# EAGLE design untitled (EAGLE 5.08)
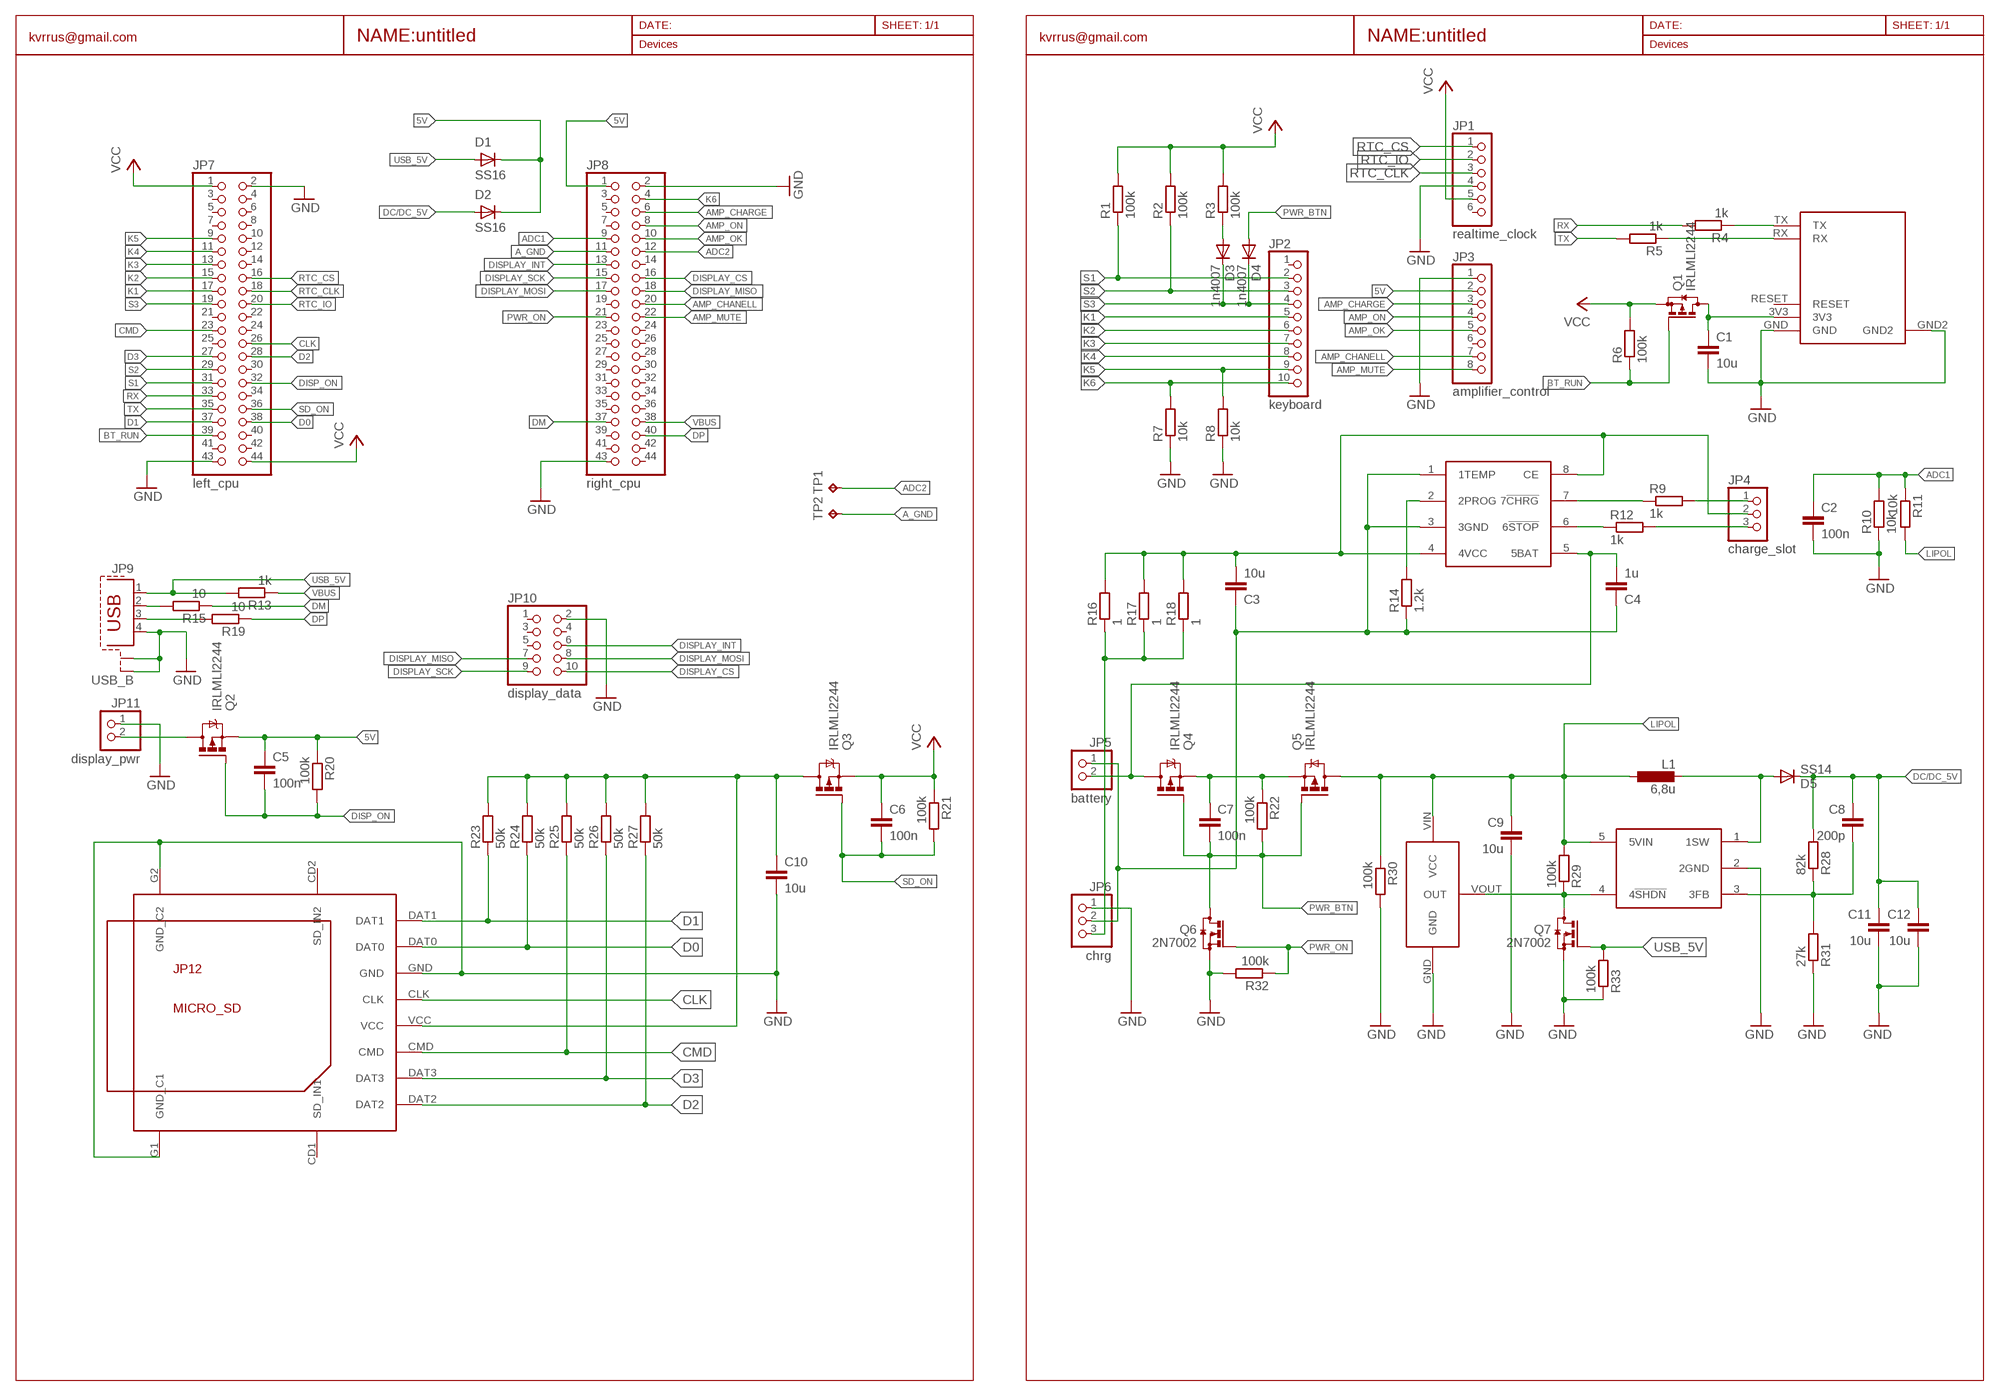
[diagram p0: schematic, sheet 1]

## Parts
C1  10u  C-EUC0805  [C0805]
C2  100n  C-EUC0805  [C0805]
C3  10u  C-EUC0805  [C0805]
C4  1u  C-EUC0805  [C0805]
C5  100n  C-EUC0805  [C0805]
C6  100n  C-EUC0805  [C0805]
C7  100n  C-EUC0805  [C0805]
C8  200p  C-EUC0805  [C0805]
C9  10u  C-EUC0805  [C0805]
C10  10u  C-EUC0805  [C0805]
C11  10u  C-EUC0805  [C0805]
C12  10u  C-EUC0805  [C0805]
D1  SS16  GF1  [SMA-DO214AC]
D2  SS16  GF1  [SMA-DO214AC]
D3  1n4007  CGRM4007-G  [SOD-123_MINI-SMA]
D4  1n4007  CGRM4007-G  [SOD-123_MINI-SMA]
D5  SS14  MBR0520LT  [SOD123]
JP1  realtime_clock  PINHD-1X6  [1X06]
JP2  keyboard  PINHD-1X10  [1X10]
JP3  amplifier_control  PINHD-1X08_2.00  [1X08M]
JP4  charge_slot  PINHD-1X3  [1X03]
JP5  battery  PINHD-1X2  [1X02]
JP6  chrg  PINHD-1X3  [1X03]
JP7  left_cpu  PINHD-2X22_2.54-SMD  [2X22SMD]
JP8  right_cpu  PINHD-2X22_2.54-SMD  [2X22SMD]
JP9  USB_B  PN61729-S  [PN61729-S]
JP10  display_data  PINHD-2X05_2.54-SMD  [2X05SMD]
JP11  display_pwr  PINHD-1X2  [1X02]
JP12  MICRO_SD  [MICRO_SD_EASY]
L1  6,8u  L-EUPIS2816  [PIS2816]
Q1  IRLMLl2244  BSS84  [SOT23]
Q2  IRLMLl2244  IRLML5203  [MICRO3]
Q3  IRLMLl2244  IRLML5203  [MICRO3]
Q4  IRLMLl2244  IRLML5203  [MICRO3]
Q5  IRLMLl2244  IRLML5203  [MICRO3]
Q6  2N7002  BSS123  [SOT23]
Q7  2N7002  BSS123  [SOT23]
R1  100k  R-EU_M1206  [M1206]
R2  100k  R-EU_M1206  [M1206]
R3  100k  R-EU_M0805  [M0805]
R4  1k  R-EU_M0805  [M0805]
R5  1k  R-EU_M0805  [M0805]
R6  100k  R-EU_M0805  [M0805]
R7  10k  R-EU_M0805  [M0805]
R8  10k  R-EU_M0805  [M0805]
R9  1k  R-EU_M0805  [M0805]
R10  10k  R-EU_M0805  [M0805]
R11  10k  R-EU_M0805  [M0805]
R12  1k  R-EU_M0805  [M0805]
R13  1k  R-EU_M0805  [M0805]
R14  1.2k  R-EU_M0805  [M0805]
R15  10  R-EU_M0805  [M0805]
R16  1  R-EU_M0805  [M0805]
R17  1  R-EU_M0805  [M0805]
R18  1  R-EU_M0805  [M0805]
R19  10  R-EU_M0805  [M0805]
R20  100k  R-EU_M0805  [M0805]
R21  100k  R-EU_M0805  [M0805]
R22  100k  R-EU_M0805  [M0805]
R23  50k  R-EU_M0805  [M0805]
R24  50k  R-EU_M0805  [M0805]
R25  50k  R-EU_M0805  [M0805]
R26  50k  R-EU_M0805  [M0805]
R27  50k  R-EU_M0805  [M0805]
R28  82k  R-EU_M0805  [M0805]
R29  100k  R-EU_M0805  [M0805]
R30  100k  R-EU_M0805  [M0805]
R31  27k  R-EU_M0805  [M0805]
R32  100k  R-EU_M0805  [M0805]
R33  100k  R-EU_M0805  [M0805]
TP1  TPPAD1-13  [P1-13]
TP2  TPPAD1-13  [P1-13]
U$1  BLUETOOTH  [BLUETOOTH]
U$2  TP4056  [SO08]
U$3  LM2731  [SOT23-5]
U$5  UVLO  [TO-92]

## Nets
5V: C5.1 D1.K(C) D2.K(C) JP3.2 JP8.1 Q2.2(S) R20.1
A_GND: JP8.11 TP2.TP
ADC1: C2.1 JP8.9 R10.2 R11.1
ADC2: JP8.12 TP1.TP
AMP_CHANELL: JP3.7 JP8.20
AMP_CHARGE: JP3.3 JP8.6
AMP_MUTE: JP3.8 JP8.22
AMP_OK: JP3.5 JP8.10
AMP_ON: JP3.4 JP8.8
BT_RUN: JP7.39 Q1.1(G) R6.1
CLK: JP7.26 JP12.CLK
CMD: JP7.23 JP12.CMD R25.1
D0: JP7.38 JP12.DAT0 R24.1
D1: JP7.37 JP12.DAT1 R23.1
D2: JP7.28 JP12.DAT2 R27.1
D3: JP7.27 JP12.DAT3 R26.1
DC/DC_5V: C8.1 C11.1 C12.1 D2.A D5.C R28.2
DISP_ON: C5.2 JP7.32 Q2.1(G) R20.2
DISPLAY_CS: JP8.16 JP10.10
DISPLAY_INT: JP8.13 JP10.6
DISPLAY_MISO: JP8.18 JP10.7
DISPLAY_MOSI: JP8.17 JP10.8
DISPLAY_SCK: JP8.15 JP10.9
DM: JP8.37 R15.1
DP: JP8.40 R19.1
GND: C1.2 C2.2 C9.2 C10.2 C11.2 C12.2 JP1.4 JP3.1 JP6.1 JP7.2 JP7.43 JP8.2 JP8.43 JP9.4 JP9.S1 JP9.S2 JP10.2 JP11.1 JP12.G1(GND_C1) JP12.G2(GND_C2) JP12.GND Q6.2(S) Q7.2(S) R7.1 R8.1 R10.1 R30.2 R31.1 R32.2 R33.1 U$1.GND U$1.GND2 U$3.2(2GND) U$5.GND
K1: JP2.5 JP7.17
K2: JP2.6 JP7.15
K3: JP2.7 JP7.13
K4: JP2.8 JP7.11
K5: JP2.9 JP7.9 R8.2
K6: JP2.10 JP8.4 R7.2
LIPOL: C9.1 L1.1 Q5.3(D) R11.2 R29.2 R30.1 U$3.5(5VIN) U$5.VIN(VCC)
N$1: R4.1 U$1.TX
N$2: R5.1 U$1.RX
N$3: C7.1 Q4.2(S) Q5.2(S) R22.1
N$4: JP11.2 Q2.3(D)
N$6: JP6.3 R16.1 R17.1 R18.1
N$7: C1.1 Q1.3(D) U$1.3V3
N$8: R14.2 U$2.2(2PROG)
N$9: C8.2 R28.1 R31.2 U$3.3(3FB)
N$10: C4.2 JP5.2 Q4.3(D) U$2.5(5BAT)
N$12: D5.A L1.2 U$3.1(1SW)
N$13: JP9.2 R15.2
N$14: R9.1 U$2.7(7!CHRG)
N$16: D3.A R3.1
N$17: R12.1 U$2.6(6!STOP)
N$18: Q7.3(D) R29.1 U$3.4(4!SHDN) U$5.VOUT(OUT)
N$19: JP4.1 R9.2
N$20: JP4.3 R12.2
N$21: C3.1 C4.1 JP5.1 JP6.2 R14.1 U$2.1(1TEMP) U$2.3(3GND)
N$22: C3.2 JP4.2 R16.2 R17.2 R18.2 U$2.4(4VCC) U$2.8(CE)
N$23: JP9.3 R19.2
N$26: C10.1 JP12.VCC Q3.3(D) R23.2 R24.2 R25.2 R26.2 R27.2
PWR_BTN: C7.2 D4.A Q4.1(G) Q5.1(G) Q6.3(D) R22.2
PWR_ON: JP8.21 Q6.1(G) R32.1
RTC_CLK: JP1.3 JP7.18
RTC_CS: JP1.1 JP7.16
RTC_IO: JP1.2 JP7.20
RX: JP7.33 R4.2
S1: JP2.2 JP7.31 R1.1
S2: JP2.3 JP7.29 R2.1
S3: D3.C D4.C JP2.4 JP7.19
SD_ON: C6.2 JP7.36 Q3.1(G) R21.2
TX: JP7.35 R5.2
USB_5V: D1.A JP9.1 Q7.1(G) R13.2 R33.2
VBUS: JP8.38 R13.1
VCC: C6.1 JP1.5 JP7.1 JP7.44 Q1.2(S) Q3.2(S) R1.2 R2.2 R3.2 R6.2 R21.1
Unconnected: JP1.6 JP2.1 JP3.6 JP7.3 JP7.4 JP7.5 JP7.6 JP7.7 JP7.8 JP7.10 JP7.12 JP7.14 JP7.21 JP7.22 JP7.24 JP7.25 JP7.30 JP7.34 JP7.40 JP7.41 JP7.42 JP8.3 JP8.5 JP8.7 JP8.14 JP8.19 JP8.23 JP8.24 JP8.25 JP8.26 JP8.27 JP8.28 JP8.29 JP8.30 JP8.31 JP8.32 JP8.33 JP8.34 JP8.35 JP8.36 JP8.39 JP8.41 JP8.42 JP8.44 JP10.1 JP10.3 JP10.4 JP10.5 JP12.CD1(SD_IN1) JP12.CD2(SD_IN2) U$1.RESET

## Notes on the sheet
- kvrrus@gmail.com | kvrrus@gmail.com

## Library data of the parts
C1-C12 = rcl:C-EU: CAPACITOR, European symbol
D1 D2 = diode:GF1: DIODE
D3 D4 = diode:CGRM400*-G: Molded plasitc,JEDEC SOD-123/Mini SMA Source: Comchip CGRM4001-G.pdf
D5 = diode:MBR0520LT: SCHOTTKY BARRIER RECTIFIER Source: http://onsemi.com .. MBR0520LT1-D.pdf
JP1 = pinhead:PINHD-1X6: PIN HEADER
JP2 = pinhead:PINHD-1X10: PIN HEADER
JP3 = pinhead-2:PINHD-1X08: PIN HEADER
JP4 JP6 = pinhead:PINHD-1X3: PIN HEADER
JP5 JP11 = pinhead:PINHD-1X2: PIN HEADER
JP7 JP8 = pinhead-2:PINHD-2X22: PIN HEADER
JP9 = con-berg:PN61729-S: BERG USB connector
JP10 = pinhead-2:PINHD-2X05: PIN HEADER
JP12 = connectors:MICRO_SD
L1 = rcl:L-EU: INDUCTOR, European symbol
Q1 = transistor-small-signal:BSS84: P-CHANNEL MOS FET
Q2-Q5 = transistor-power:IRLML5203: HEXFET P-Channel Power MOSFET
Q6 Q7 = transistor-small-signal:BSS123: N-CHANNEL MOS FET
R1-R33 = rcl:R-EU_: RESISTOR, European symbol
TP1 TP2 = testpad:TP: Test pad
U$1 = connectors:BLUETOOTH
U$2 = stabil:TP4056
U$3 = stabil:LM2731
U$5 = stabil:UVLO

## Board
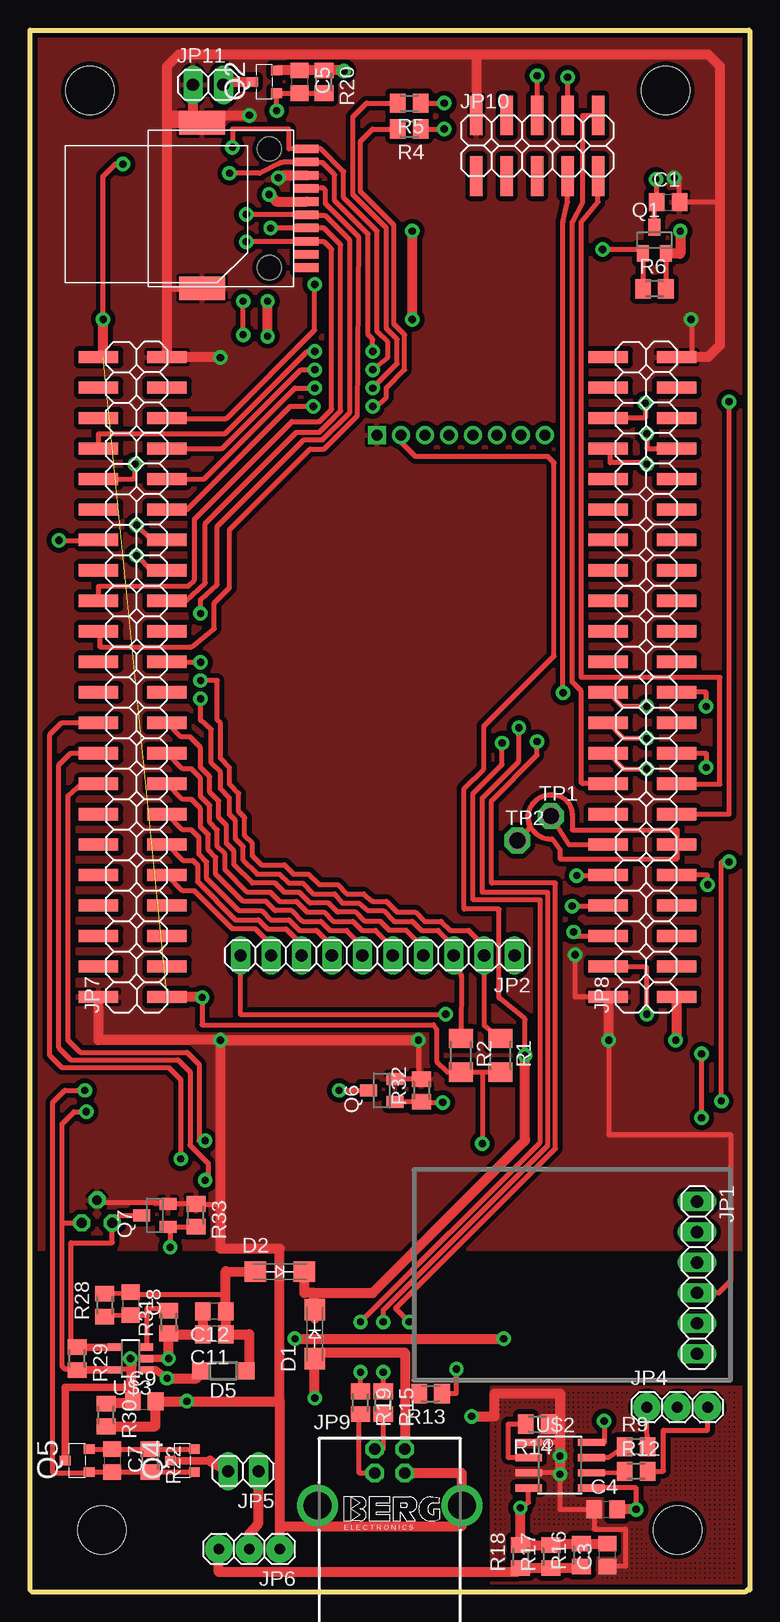
[diagram p1: board, top side]
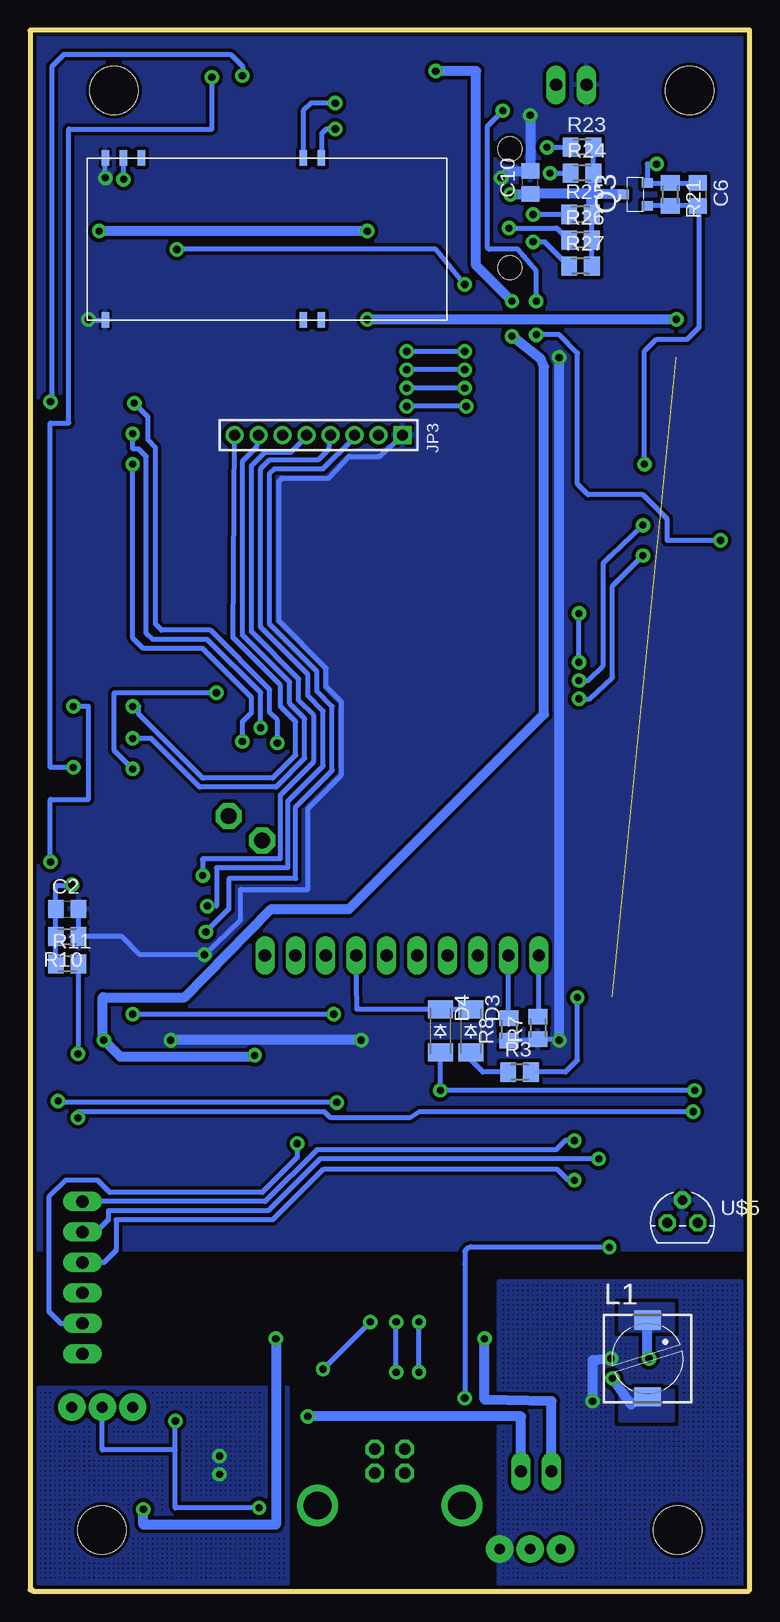
[diagram p2: board, bottom side, seen from below]

Size 60 x 130.18 mm. Coordinates in mm from the lower left corner, seen from the top.
Outline: 0,0.13 0,130.13
Outline: 60,130.13 60,0.13
Outline: 0.13,0 59.69,0 59.94,0.25
Outline: 0,130.18 59.94,130.18
Copper layers (1*16): Top 0.035mm / dielectric 1.5mm / Bottom 0.035mm
Design rules "default *": minimum track width 0.3mm, minimum drill 0.3mm, track to track 0.22mm, track to pad 0.22mm, pad to pad 0.22mm, via to via 0.22mm, smd to smd 0.22mm, copper to edge 0.035mm, drill to drill 0.035mm, minimum pad ring 0.3mm, minimum via ring 0.3mm, stop-mask expansion 4mil, vias tented up to drill 0mil, thermal gap 10mil
Holes 4 mm at 6,5.13 54,5.13 5,125.13 53,125.13

### Footprints (pad centres in the part's own frame; a part is rotated, then mirrored left to right if it is on the bottom)
C0805 = smd 1.3 x 1.5: 1 -0.95,0; 2 0.95,0
SMA-DO214AC = smd 1.8 x 1.7: A -2.05,0; K 2.05,0
SOD-123_MINI-SMA = smd 1.5 x 2.1: A 1.8,0; C -1.8,0
SOD123 = smd 1.4 x 1.4: A 1.9,0; C -1.9,0
1X06 = drill 1.016 long: 1 -6.35,0; 2 -3.81,0; 3 -1.27,0; 4 1.27,0; 5 3.81,0; 6 6.35,0
1X10 = drill 1.016 long: 1 -11.43,0; 2 -8.89,0; 3 -6.35,0; 4 -3.81,0; 5 -1.27,0; 6 1.27,0; 7 3.81,0; 8 6.35,0; 9 8.89,0; 10 11.43,0
1X08M = drill 0.914 square: 1 -7,0 | drill 0.914: 2 -5,0; 3 -3,0; 4 -1,0; 5 1,0; 6 3,0; 7 5,0; 8 7,0
1X03 = drill 0.9 pad 2.286: 1 -2.54,0; 2 0,0; 3 2.54,0
1X02 = drill 1.016 long: 1 -1.27,0; 2 1.27,0
2X22SMD = smd 1.016 x 3.302: 1 -1.27,-3.81; 2 -1.27,1.905; 3 1.27,-3.81; 4 1.27,1.905; 5 3.81,-3.81; 6 3.81,1.905; 7 6.35,-3.81; 8 6.35,1.905; 9 8.89,-3.81; 10 8.89,1.905; 11 11.43,-3.81; 12 11.43,1.905; 13 13.97,-3.81; 14 13.97,1.905; 15 16.51,-3.81; 16 16.51,1.905; 17 19.05,-3.81; 18 19.05,1.905; 19 21.59,-3.81; 20 21.59,1.905; 21 24.13,-3.81; 22 24.13,1.905; 23 26.67,-3.81; 24 26.67,1.905; 25 29.21,-3.81; 26 29.21,1.905; 27 31.75,-3.81; 28 31.75,1.905; 29 34.29,-3.81; 30 34.29,1.905; 31 36.83,-3.81; 32 36.83,1.905; 33 39.37,-3.81; 34 39.37,1.905; 35 41.91,-3.81; 36 41.91,1.905; 37 44.45,-3.81; 38 44.45,1.905; 39 46.99,-3.81; 40 46.99,1.905; 41 49.53,-3.81; 42 49.53,1.905; 43 52.07,-3.81; 44 52.07,1.905
PN61729-S = drill 0.95 octagon: 1 1.25,4.71; 2 -1.25,4.71; 3 -1.25,2.71; 4 1.25,2.71 | drill 2.3 pad 2.9: S1 -6.02,0; S2 6.02,0
2X05SMD = smd 1.016 x 3.302: 1 -1.27,-3.81; 2 -1.27,1.27; 3 1.27,-3.81; 4 1.27,1.27; 5 3.81,-3.81; 6 3.81,1.27; 7 6.35,-3.81; 8 6.35,1.27; 9 8.89,-3.81; 10 8.89,1.27
MICRO_SD_EASY = smd 2 x 0.711: CD1 1.1,0; CD2 1.1,1.1; CLK 1.1,6.6; CMD 1.1,4.4; DAT0 1.1,8.8; DAT1 1.1,9.9; DAT2 1.1,2.2; DAT3 1.1,3.3; GND 1.1,7.7; VCC 1.1,5.5 | smd 3.81 x 1.93: G1 -7.62,-1.735; G2 -7.62,12.065 | hole 2: -2,9.9; -2,0
PIS2816 = smd 2.2 x 1.6: 1 0,3.2; 2 0,-3.2
SOT23 = smd 1 x 1.4: 1 -0.95,-1.1; 2 0.95,-1.1; 3 0,1.1
MICRO3 = smd 0.8 x 0.9: 1 -0.95,-1; 2 0.95,-1; 3 0,1
M1206 = smd 1.6 x 2: 1 -1.4,0; 2 1.4,0
M0805 = smd 1.3 x 1.6: 1 -0.95,0; 2 0.95,0
P1-13 = drill 1.321 pad 2.159 octagon: TP 0,0
BLUETOOTH = smd 1.27 x 0.635: 3V3 0,1.5; GND 0,0; GND2 13.5,0; RESET 0,3; RX 0,16.5; RX_LED 13.5,16.5; TX 0,18; TX_LED 13.5,18
SO08 = smd 0.61 x 2.21: 1 -1.905,-2.616; 2 -0.635,-2.616; 3 0.635,-2.616; 4 1.905,-2.616; 5 1.905,2.616; 6 0.635,2.616; 7 -0.635,2.616; 8 -1.905,2.616
SOT23-5 = smd 0.6 x 1.2: 1 -0.95,-1.306; 2 0,-1.306; 3 0.95,-1.306; 4 0.95,1.306; 5 -0.95,1.306
TO-92 = drill 0.813 octagon: GND 0,1.905; VIN 1.27,0; VOUT -1.27,0

### Placement (x,y rotation side)
C1  53.21,115.82 0 top
C2  56.9,56.9 0 bottom
C3  48.13,3.05 90 top
C4  48.01,6.86 0 top
C5  22.48,125.86 270 top
C6  4.32,116.46 270 bottom
C7  6.86,10.92 270 top
C8  8.38,24 270 top
C9  9.53,15.88 0 top
C10  18.29,117.47 90 bottom
C11  15.37,21.46 180 top
C12  15.37,23.37 180 top
D1  23.75,21.46 90 top
D2  20.83,26.67 0 top
D3  23.24,46.74 270 bottom
D4  25.78,46.74 270 bottom
D5  16.13,18.41 180 top
JP1  55.63,26.16 270 top
JP2  28.98,53.03 180 top
JP3  35.94,96.39 180 bottom
JP4  53.98,15.37 0 top
JP5  17.78,10.03 180 top
JP6  18.29,3.56 180 top
JP7  7.62,50.84 90 top
JP8  50.12,50.84 90 top
JP9  30,7.16 0 top
JP10  38.48,121.79 0 top
JP11  14.86,125.6 0 top
JP12  21.97,110.36 0 top
L1  8.51,19.43 0 bottom
Q1  52.07,112.65 0 top
Q2  19.56,125.86 90 top
Q3  9.53,116.46 90 bottom
Q4  12.7,10.92 90 top
Q5  3.94,10.92 90 top
Q6  29.34,41.78 90 top
Q7  10.41,31.37 90 top
R1  39.24,44.7 270 top
R2  35.94,44.7 270 top
R3  19.18,43.31 0 bottom
R4  31.62,121.92 180 top
R5  31.62,124.08 180 top
R6  52.07,108.58 0 top
R7  17.65,46.99 90 bottom
R8  20.07,46.86 90 bottom
R9  50.55,12.07 0 top
R10  56.9,54.61 180 bottom
R11  56.9,52.32 0 bottom
R12  50.55,10.03 0 top
R13  33.4,16.51 180 top
R14  42.29,13.97 180 top
R15  29.46,15.75 270 top
R16  45.97,3.05 90 top
R17  43.43,2.92 90 top
R18  40.89,2.92 90 top
R19  27.56,15.75 270 top
R20  24.51,125.86 270 top
R21  6.6,116.46 270 bottom
R22  10.03,10.92 270 top
R23  13.97,120.4 0 bottom
R24  13.97,118.24 0 bottom
R25  14.1,114.81 0 bottom
R26  14.1,112.65 0 bottom
R27  14.1,110.49 0 bottom
R28  6.22,23.88 90 top
R29  3.94,19.43 270 top
R30  6.35,14.73 270 top
R31  11.56,22.48 90 top
R32  32.64,41.78 90 top
R33  13.84,31.37 270 top
TP1  43.43,64.64 0 top
TP2  40.64,62.61 0 top
U$1  53.72,119.51 270 bottom
U$2  44.2,10.54 270 top
U$3  8.38,19.43 90 top
U$5  5.59,30.73 0 bottom

### Tracks (layer width: path | path; a pad name or v marks a point on that pad's centre or on a via)
5V  (via drill 0.6)
  Top 0.406: v41.27,44.7 41.27,47.65 arc45 41.2,47.83 39.19,49.46 arc-45 39.12,49.51 39.12,56.9 36.2,56.9 36.2,66.93 37.85,68.58 37.85,72.14 43.69,77.98 43.69,94.11 43.18,94.61 32.13,94.61 31.07,95.68 JP3.2
  Top 0.813: v53.85,45.97 53.93,46.06 JP8.1 | v41.27,44.7 41.27,37.7 arc-45 41.2,37.52 28.57,24.89 23.75,24.89 | v19.81,104.65 v19.81,107.57 | 23.75,24.89 22.88,24.89 D2.K | 23.75,22.75 D1.K 23.75,24.89 | C5.1 22.48,126.75 | C5.1 Q2.2 | C5.1 R20.1 26.16,126.81 v26.16,126.75
  Bottom 0.813: v19.81,107.57 22.8,110.56 22.8,126.75 v26.16,126.75 | v41.27,44.7 41.27,44.58 52.45,44.58 v53.85,45.97 53.93,46.06 JP8.1 53.89,49.53 47.12,49.53 39.88,56.9 33.4,56.9 17.14,73.15 17.14,102.11 17.4,102.74 v19.81,104.65
A_GND
  Top 0.406: 53.98,62.27 JP8.11 | 53.98,62.27 53.98,61.09 44.2,61.09 44.2,61.85 43.56,62.74 arc-90 41.53,64.52 | 53.98,62.27 53.98,63.5 | 53.93,63.5 45.21,63.5 45.21,64.77 arc90 43.56,66.42 43.43,66.42 arc90 41.53,64.52 | TP2.TP 41.66,63.63 41.66,63.88 41.53,64.52
ADC1  (via drill 0.6)
  Top 0.406: JP8.9 56.52,59.73 v56.52,58.93
  Bottom 0.406: v56.52,58.93 56.52,58.87 57.85,58.87 C2.1 R10.2 R11.1
ADC2
  Top 0.406: JP8.12 44.96,62.27 TP1.TP
AMP_CHANELL  (via drill 0.6)
  Top 0.406: JP8.20 49.52,71.12 v51.44,71.12
  Bottom 0.406: v51.44,71.12 49.91,71.12 45.85,67.06 39.5,67.06 37.08,69.47 37.08,72.77 38.35,74.04 38.35,75.82 42.29,79.76 42.29,94.23 41.07,95.46 JP3.7
AMP_CHARGE  (via drill 0.6)
  Top 0.406: v45.34,54.99 45.34,54.65 JP8.6
  Bottom 0.406: v45.34,54.99 43.43,56.9 43.43,59.44 37.85,59.44 37.85,65.41 34.8,68.45 34.8,73.79 36.07,75.06 36.07,76.71 40.01,80.64 40.01,93.22 39.62,93.6 35.56,93.6 33.07,96.09 JP3.3
AMP_MUTE  (via drill 0.6)
  Top 0.406: JP8.22 49.4,73.79 v51.44,73.79
  Bottom 0.406: v51.44,73.79 50.93,73.79 50.93,73.15 45.59,67.82 39.75,67.82 37.85,69.72 37.85,72.52 39.12,73.79 39.12,75.56 43.07,79.52 JP3.8
AMP_OK  (via drill 0.6)
  Top 0.406: JP8.10 48.18,59.69 v45.59,59.69
  Bottom 0.406: 45.59,60.96 v45.59,59.69 | 45.59,60.96 45.59,61.09 | 45.59,60.96 45.47,61.09 39.12,61.09 39.12,66.41 36.32,69.2 36.32,73.02 37.59,74.3 37.59,76.07 41.53,80.01 41.53,93.85 40.39,95 38.23,95 37.07,96.16 JP3.5
AMP_ON  (via drill 0.6)
  Top 0.406: JP8.8 48.22,57.15 v45.21,57.15
  Bottom 0.406: v45.21,57.15 44.45,57.15 44.45,60.33 38.48,60.33 38.48,65.91 35.56,68.83 35.56,73.41 36.83,74.68 36.83,76.45 40.77,80.39 40.77,93.6 40.01,94.36 35.94,94.36 35.07,95.23 JP3.4
BT_RUN  (via drill 0.6)
  Top 0.406: JP7.39 11.47,97.79 16.38,97.79 23.75,105.16 v23.75,108.97 | v47.75,111.89 50.78,111.89 Q1.1 R6.1
  Bottom 0.406: v47.75,111.89 26.16,111.89 v23.75,108.97
CLK
  Top 0.406: JP12.CLK 24.51,116.97 24.64,116.84 24.64,115.7 27.43,112.9 27.3,98.03 24.53,95.25 23.37,95.25 16.64,88.52 16.64,83.69 15.37,82.42 15.37,80.26 13.46,78.74 5.84,78.74 5.84,80.05 JP7.26
CMD  (via drill 0.6)
  Top 0.406: JP12.CMD 23.07,114.81 | v18.03,114.81 18.08,114.76 JP12.CMD | JP7.23 14.13,77.51 v14.22,77.47 | JP12.CMD 23.15,114.68 24.64,114.68 26.67,112.65 26.67,98.28 24.4,96.01 22.86,96.01 15.62,88.77 15.62,83.95 14.22,82.68 v14.22,81.53
  Bottom 0.406: v18.03,114.81 R25.1 | v14.22,77.47 v14.22,81.53
D0  (via drill 0.6)
  Top 0.406: JP12.DAT0 23.07,119.13 | JP7.38 5.71,96.52 16.26,96.52 23.11,103.38 v23.75,103.38 | JP12.DAT0 21.3,119.16 arc24 20.69,119.01 19.23,118.26 arc-24 19.12,118.24 v16.64,118.24 | v28.57,103.38 28.57,104.39 28.19,104.77 28.19,113.16 25.4,115.95 25.4,118.11 24.38,119.13 23.11,119.13 JP12.DAT0
  Bottom 0.406: v16.64,118.24 R24.1 | v23.75,103.38 v28.57,103.38
D1  (via drill 0.6)
  Top 0.406: v16.89,120.4 16.89,121.92 21.59,121.92 21.59,120.26 JP12.DAT1 24.26,120.27 26.16,118.36 26.16,116.2 28.96,113.41 28.96,105.03 29.84,104.14 29.84,102.87 v28.57,101.85 | JP7.37 16.04,95.29 22.61,101.85 v23.75,101.85
  Bottom 0.406: v16.89,120.4 R23.1 | v23.75,101.85 v28.57,101.85
D2  (via drill 0.6)
  Top 0.406: JP7.28 5.71,83.82 13.21,83.82 13.72,84.33 13.72,89.41 21.84,97.54 24.15,97.54 25.15,98.54 25.15,111.89 24.51,112.52 23.11,112.52 JP12.DAT2 23.07,112.52 v18.03,112.52
  Bottom 0.406: v18.03,112.52 17.18,112.52 arc45 17,112.45 R27.1
D3  (via drill 0.6)
  Top 0.406: JP12.DAT3 | v20.07,113.66 JP12.DAT3 | JP12.DAT3 24.51,113.66 25.91,112.27 25.91,98.41 24.15,96.65 22.23,96.65 14.61,89.03 14.61,84.07 12.99,82.59 JP7.27
  Bottom 0.406: v20.07,113.66 16.17,113.66 arc45 15.99,113.59 R26.1
DC/DC_5V
  Top 0.406: R28.2 C8.1 8.57,24.77 16,24.77 16.32,24.32 C12.1
  Top 0.813: D5.C 18.29,18.42 18.29,21.46 C11.1 C12.1 16.32,26.71 D2.A
DISP_ON  (via drill 0.6)
  Top 0.406: R20.2 C5.2 Q2.1 20.57,124.89 v20.57,123.44 | JP7.32 5.71,87.63 v2.41,87.63 | v17.78,104.77 v17.78,107.57
  Bottom 0.406: v2.41,87.63 6.86,87.63 6.86,89.41 8.89,91.44 13.46,91.44 14.35,92.33 14.35,103.25 15.88,104.77 v17.78,104.77 | v17.78,107.57 17.78,110.11 19.3,111.89 21.72,111.89 21.84,112.01 21.84,122.17 v20.57,123.44
DISPLAY_CS
  Top 0.406: 48.13,67.44 48.13,67.35 JP8.16 46.06,67.35 45.97,67.44 45.97,75.06 45.21,75.82 45.21,114.17 46.1,115.82 46.1,123.06 JP10.10
DISPLAY_INT  (via drill 0.6)
  Top 0.406: JP8.13 58.29,64.81 v58.29,99.19 | v42.29,126.36 JP10.6
  Bottom 0.406: v58.29,99.19 58.17,99.19 58.17,127.14 57.17,128.14 43.29,128.14 42.29,127.14 v42.29,126.36
DISPLAY_MISO  (via drill 0.6)
  Top 0.406: JP10.7 44.83,115.82 44.45,114.17 v44.45,74.93 | JP8.18 48.22,69.85 49.48,68.58 v51.44,68.58
  Bottom 0.406: v51.44,68.58 52.96,70.1 52.96,74.93 v44.45,74.93
DISPLAY_MOSI  (via drill 0.6)
  Top 0.406: JP8.17 56.39,69.89 v56.39,68.71 | v44.83,126.24 JP10.8
  Bottom 0.406: 44.83,126.36 v44.83,126.24 44.83,121.92 56.77,121.92 56.77,97.41 58.29,97.41 58.29,68.71 v56.39,68.71
DISPLAY_SCK
  Top 0.406: JP10.9 47.37,115.82 45.97,114.17 45.97,76.2 57.53,76.2 57.53,67.31 53.93,67.31 JP8.15
DM  (via drill 0.6)
  Top 0.406: JP8.37 51.44,95.29 v51.44,96.52 | v29.46,22.48 29.46,23.47 43.18,37.19 43.18,58.29 37.72,58.29 37.72,66.17 40.77,69.21 v40.77,72.01 | R15.1 v29.46,18.29
  Bottom 0.406: v51.44,96.52 51.44,95.25 50.93,95.25 50.29,94.61 50.29,79.88 49.78,79.38 45.21,79.38 40.77,74.93 v40.77,72.01 | v29.46,18.29 v29.46,22.48
DP  (via drill 0.6)
  Top 0.406: JP8.40 51.31,97.83 v51.31,99.06 | v27.56,22.48 42.55,37.47 42.55,57.66 36.96,57.66 36.96,66.55 39.37,68.96 v39.37,70.74 | R19.1 v27.56,18.29
  Bottom 0.406: v51.31,99.06 50.16,97.92 50.16,96.01 49.53,95.38 49.53,80.64 49.02,80.14 44.96,80.14 40.01,75.18 40.01,73.28 39.37,72.64 v39.37,70.74 | v27.56,18.29 v27.56,22.48
GND  (via drill 0.6)
  Top 0.406: 48.22,49.53 JP8.2 45.63,49.57 45.47,49.53 v45.47,53.09 | v53.72,117.86 54.16,117.86 C1.2 | v55.12,106.05 55.24,106.05 55.24,102.91 | R33.1 12.38,32.32 | R33.1 Q7.2 arc45 11.36,32.39 5.84,32.39 U$5.GND | 32.38,42.73 R32.2 | 32.38,42.73 Q6.2 | v32.38,45.97 32.38,42.73 | R33.1 13.27,32.26 15.88,32.26 | 11.56,21.46 R31.1 | JP1.4 57.42,24.89 58.42,25.89 58.42,38.1 48.26,38.1 v48.26,45.97 | C1.2 54.1,115.82 54.1,115.95 54.23,115.82 | 57.53,115.82 54.23,115.82 | 54.23,115.82 C1.2 | 11.43,108.58 11.43,108.63 JP12.G1 14.35,108.58 11.43,108.58
  Top 0.61: v11.56,19.43 U$3.2
  Top 0.813: 11.43,108.58 JP7.43 15.84,102.91 v15.88,102.87 | 11.43,108.63 11.43,122.43 | 13.59,122.43 JP12.G2 | 37.21,128.14 JP10.2 | 11.43,122.43 11.43,123.06 | JP8.43 55.24,102.91 56.53,102.91 57.53,103.91 57.53,115.82 57.53,127.14 56.53,128.14 37.21,128.14 | 5.71,45.97 JP7.2 | v15.88,45.97 v32.38,45.97 | v15.88,45.97 15.88,32.26 15.88,28.57 20.83,28.57 20.83,15.88 | 20.83,5.46 JP6.1 | 20.83,15.88 20.83,5.46 | 20.83,5.46 23.98,5.46 | 23.98,5.46 JP9.S1 | JP9.4 36.02,9.87 JP9.S2 36.02,5.46 23.98,5.46 | v48.26,45.97 48.26,49.52 JP8.2 | 11.43,123.06 v18.29,123.06 | v20.7,117.86 21.09,117.99 arc-45 21.27,118.06 JP12.GND | v11.56,19.43 11.56,21.46 C11.2 C12.2 | 20.83,15.88 v13.08,15.88 C9.2 10.47,13.78 R30.2 | 11.43,123.06 11.43,127.14 12.43,128.14 37.21,128.14 | v15.88,45.97 5.71,45.97 | 5.71,45.97 5.84,46.1 | 13.59,122.43 JP11.1 | 11.43,122.43 13.59,122.43
  Bottom 0.406: C10.2 18.35,118.36 | R8.1 R7.1 15.88,46.04 v15.88,45.97 | v53.72,117.86 U$1.GND | U$1.GND2 55.12,106.01 v55.12,106.05 | C2.2 R10.1 52.32,54.61 50.8,53.09 v45.47,53.09 42.42,56.01 42.42,58.55 36.83,58.55 36.83,65.28 34.04,68.07 34.04,74.17 35.31,75.44 35.31,76.96 39.24,80.9 39.24,92.58 38.99,92.84 35.05,92.84 33.4,94.61 30.99,94.61 30.85,94.63 JP3.1
  Bottom 0.813: v18.29,123.06 C10.2 | v32.38,45.97 v48.26,45.97 | 18.35,118.36 20.19,118.36 v20.7,117.86 | v11.56,19.43 13.08,19.3 v13.08,15.88 | v15.88,45.97 v15.88,102.87
  pour Bottom (isolate 0.305, rank 6, no thermals, hatched): 0.64,25.91 20.95,25.91 20.95,0.51 0.64,0.51
  pour Top (isolate 0.406, rank 6): 0,130.18 59.94,130.18 60.07,98.93 60.07,28.57 0,28.57
  pour Bottom (isolate 0.305, rank 5): 60.07,28.57 0.13,28.57 0.13,130.05 60.07,130.05
K1
  Top 0.406: JP7.17 12.74,68.58 13.46,68.58 14.22,67.82 14.22,66.29 14.99,65.53 14.99,64.13 15.62,63.5 15.62,62.1 16.26,61.47 16.26,60.2 18.16,58.29 20.07,58.29 20.83,57.53 22.23,57.53 23.11,56.64 24.51,56.64 25.27,55.88 26.92,55.88 27.69,55.12 28.83,55.12 30.25,53.69 JP2.5
K2
  Top 0.406: JP7.15 12.74,66.04 13.46,66.04 14.22,65.28 14.22,63.75 14.86,63.12 14.86,61.85 15.49,61.21 15.49,59.82 17.78,57.53 19.68,57.53 20.45,56.77 21.84,56.77 22.73,55.88 24.26,55.88 25.02,55.12 26.42,55.12 27.71,53.82 JP2.6
K3
  Top 0.406: JP7.13 12.74,63.5 13.46,63.5 14.1,62.87 14.1,61.47 14.73,60.83 14.73,59.44 17.4,56.77 19.3,56.77 20.07,56.01 21.59,56.01 22.48,55.12 23.88,55.12 25.17,53.82 JP2.7
K4
  Top 0.406: JP7.11 12.74,60.96 13.59,60.96 13.97,60.58 13.97,59.18 17.14,56.01 19.05,56.01 19.81,55.25 21.34,55.25 22.63,53.95 JP2.8
K5
  Top 0.406: JP7.9 12.74,58.42 13.72,58.42 16.89,55.25 18.8,55.25 20.09,53.95 JP2.9
  Bottom 0.406: R8.2 20.09,47.94 JP2.9
K6  (via drill 0.6)
  Top 0.406: JP8.4 48.22,52.07 51.44,52.07 v51.44,48.13 | JP2.10 17.53,52.78 17.53,48.13 v34.67,48.13
  Bottom 0.406: R7.2 18.03,47.88 17.55,47.88 JP2.10 | v34.67,48.13 v51.44,48.13
LIPOL  (via drill 0.6)
  Top 0.406: 5.21,18.54 2.92,18.54 2.67,18.8 2.67,30.73 | 5.21,18.54 R29.2 | v56.01,39.5 v56.01,44.83 | 2.67,30.73 2.67,39.01 3.67,40.01 v4.7,40.01 | 2.67,30.73 U$5.VIN | 5.21,18.54 8.48,18.54 8.48,18.92
  Top 0.61: R29.2 U$3.5 | C9.1 8.45,16.07 8.48,16.36 8.51,16.64 8.51,17.02 8.51,17.03 2.94,17.03 Q5.3 | v8.38,19.43 8.51,19.3
  Top 0.813: v8.38,19.43 8.48,19.43 8.48,18.92 8.48,16.36 | R30.1 8.51,15.68 8.51,17.03
  Bottom 0.406: v56.01,44.83 55.95,45.65 R11.2 | v4.7,40.01 27.56,40.01 28.32,39.5 34.92,39.5 35.43,40.01 56.01,40.01 v56.01,39.5
  Bottom 0.61: v8.38,19.43 8.51,19.68
  Bottom 0.813: 8.51,19.68 L1.1
  pour Bottom (isolate 0.406, no thermals): 6.35,21.72 10.79,21.72 10.79,24 6.35,24
N$1  (via drill 0.6)
  Top 0.406: R4.1 v34.54,121.92
  Bottom 0.406: U$1.TX 35.69,119.54 35.69,121.54 35.31,121.92 v34.54,121.92
N$2  (via drill 0.6)
  Top 0.406: R5.1 v34.54,124.08
  Bottom 0.406: U$1.RX 37.21,123.44 36.58,124.08 v34.54,124.08
N$3
  Top 0.406: Q5.2 C7.1 R22.1 Q4.2
N$4
  Top 0.813: JP11.2 16.13,125.86 Q2.3
N$6
  Top 0.813: JP6.3 15.75,1.65 40.57,1.65 R18.1 R17.1 45.85,1.97 R16.1
N$7  (via drill 0.6)
  Top 0.406: 52.26,117.73 v52.2,117.73 52.26,117.66 C1.1 52.07,115.63 Q1.3
  Bottom 0.406: U$1.3V3 52.2,119.51 v52.2,117.73
N$8
  Top 0.406: U$2.2 39.88,11.18 39.88,13.97 R14.2
N$9
  Top 0.406: R28.1 C8.2 9.78,22.93 | 9.72,20.38 9.78,20.44 9.78,22.93 | R31.2 11.11,23.62 9.78,23.62 9.78,22.93
  Top 0.61: U$3.3 9.72,20.38
N$10  (via drill 0.6)
  Top 0.406: U$2.5 50.55,8.64 v50.55,6.86
  Top 0.61: Q4.3 14.99,10.92
  Top 0.813: v22.1,21.08 v39.5,21.08 | v50.55,6.86 C4.2 | 14.99,10.92 JP5.2
  Bottom 0.813: JP5.2 16.51,15.88 22.1,16 v22.1,21.08 | v39.5,21.08 39.5,5.59 50.55,5.59 v50.55,6.86
N$12  (via drill 0.6)
  Top 0.61: U$3.1 10.47,18.48 v11.43,17.78
  Top 0.813: v11.43,17.78 13.93,17.78 D5.A
  Bottom 0.813: L1.2 9.88,15.6 v11.43,17.78
  pour Bottom (isolate 0.406, no thermals): 10.79,16.76 6.35,16.76 6.35,14.22 10.79,14.22
N$13
  Top 0.406: JP9.2 29.46,11.87 R15.2
N$14
  Top 0.406: U$2.7 48.26,11.18 49.53,12.07 R9.1
N$16
  Bottom 0.406: R3.1 22.24,43.31 23.24,44.31 D3.A
N$17
  Top 0.406: U$2.6 49.6,9.96 R12.1
N$18
  Top 0.406: U$3.4 3.43,20.38 3.43,29.08 6.86,29.08 U$5.VOUT 7.49,31.37 Q7.3
  Top 0.61: R29.1 U$3.4
N$19
  Top 0.406: R9.2 51.44,14.22 JP4.1
N$20
  Top 0.406: R12.2 52.83,10.03 52.83,13.46 56.52,13.46 JP4.3
N$21  (via drill 0.6)
  Top 0.406: 44.2,12.45 U$2.1 | 44.2,12.45 v44.2,11.3 44.2,9.91 | 44.2,9.91 U$2.3 | 44.2,9.91 v44.2,9.78 44.2,6.86 C4.1 47.06,5.21 49.66,5.21 49.66,2.1 C3.1 | 44.07,14.61 44.2,14.61 44.2,13.97 | 44.2,13.59 44.2,12.45
  Top 0.813: JP5.1 19.05,5.71 18.29,4.83 JP6.2 | v36.83,14.61 38.73,14.61 38.73,16.51 44.2,16.51 44.2,13.97 | v44.2,9.78 44.2,13.59 44.2,13.97 | 44.2,13.97 R14.1
  Bottom 0.813: JP5.1 19.05,14.61 v36.83,14.61
  pour Top (isolate 0.406, rank 5, no thermals, hatched): 38.48,17.02 59.44,17.02 59.44,0.64 38.48,0.64
  pour Bottom (isolate 0.305, rank 2, hatched): 38.48,17.02 59.31,17.02 59.31,0.64 38.48,0.64
N$22  (via drill 0.6)
  Top 0.406: v47.88,14.22 47.88,12.37 U$2.8 | U$2.4 41.58,7.44 v40.89,6.98
  Top 0.813: C3.2 R16.2 43.56,4 R17.2 R18.2 v40.89,6.98
  Bottom 0.406: v40.89,6.98 47.88,6.98 47.88,11.81 | 47.88,11.81 v47.88,14.22 | JP4.2 53.98,11.81 47.88,11.81
N$23
  Top 0.406: R19.2 27.43,14.8 27.43,9.91 28.75,9.91 JP9.3
N$26  (via drill 0.6)
  Top 0.813: v19.94,116.46 20.46,115.94 arc45 20.64,115.86 JP12.VCC
  Bottom 0.406: C10.1 18.6,116.59 | R27.2 R26.2 R25.2 | R24.2 R23.2
  Bottom 0.813: Q3.3 10.59,116.52 13.08,116.52 | 13.21,116.52 13.08,116.52 | 13.21,116.52 C10.1 | R24.2 13.08,118.18 13.08,116.52 | R25.2 13.21,114.87 13.21,116.52 | 18.6,116.59 18.73,116.46 v19.94,116.46
PWR_BTN  (via drill 0.6)
  Top 0.406: 13.97,9.97 Q4.1 R22.2 C7.2 Q5.1 4.94,9.91 1.91,9.91 1.91,40.78 2.9,41.78 v4.57,41.78 | v25.78,41.78 Q6.3
  Bottom 0.406: D4.A v25.78,41.78 v4.57,41.78
PWR_ON  (via drill 0.6)
  Top 0.406: JP8.21 56.39,74.97 v56.39,73.79 | v58.29,60.83 57.66,60.83 v57.66,40.89 | v34.42,40.77 32.7,40.77 R32.1 Q6.1 30.18,40.83
  Bottom 0.406: v58.29,60.83 58.29,66.04 55.12,66.04 55.12,73.79 v56.39,73.79 | v34.42,40.77 57.66,40.77 v57.66,40.89
RTC_CLK  (via drill 0.6)
  Top 0.406: JP7.18 3.41,69.89 2.41,68.89 2.41,45.32 3.41,44.32 12.34,44.32 13.34,43.32 13.34,37.21 14.86,35.69 14.86,34.8 v14.61,34.29
  Bottom 0.406: v14.61,34.29 15.11,34.29 16,35.18 35.56,35.18 39.75,30.99 52.83,30.99 52.83,28.43 53.83,27.43 JP1.3
RTC_CS  (via drill 0.6)
  Top 0.406: JP7.16 4.3,67.35 3.17,66.35 3.17,45.96 4.17,44.96 13.1,44.96 14.1,43.96 14.1,37.59 v14.61,37.59
  Bottom 0.406: v14.61,37.59 15.37,37.59 16.13,36.83 36.07,36.83 40.39,32.51 JP1.1
RTC_IO  (via drill 0.6)
  Top 0.406: JP7.20 2.65,72.43 1.65,71.43 1.65,44.69 2.65,43.69 11.57,43.69 12.57,42.69 v12.57,36.07
  Bottom 0.406: v12.57,36.07 35.81,36.07 40.13,31.75 53.47,31.75 53.47,30.97 54.47,29.97 JP1.2
RX  (via drill 0.6)
  Top 0.406: v23.62,98.81 21.72,98.81 13.12,90.21 JP7.33 | v28.57,98.81 28.96,98.81 29.72,99.57 29.72,100.33 31.24,101.85 31.24,104.77 30.35,105.66 30.35,113.92 27.56,116.71 27.56,120.9 28.57,121.92 R4.2
  Bottom 0.406: v23.62,98.81 v28.57,98.81
S1  (via drill 0.6)
  Top 0.406: R1.1 37.87,47.22 JP2.2 37.87,53.82 36.58,55.12 35.05,55.12 34.29,55.88 32.89,55.88 32.13,56.64 30.61,56.64 29.72,57.53 28.57,57.53 27.81,58.17 26.42,58.17 25.65,58.93 24.13,58.93 23.24,59.82 21.97,59.82 21.21,60.58 19.3,60.58 18.54,61.34 18.54,62.36 17.91,62.99 17.91,64.52 17.4,65.02 17.4,66.55 16.64,67.31 16.64,68.71 15.88,69.47 15.88,72.39 15.62,72.64 15.62,75.95 v14.22,75.95 | v8.89,88.9 10.2,87.67
  Top 0.813: 10.2,87.67 JP7.31
  Bottom 0.406: v8.89,88.9 11.56,86.36 12.19,85.72 12.19,77.22 13.46,75.95 v14.22,75.95
S2  (via drill 0.6)
  Top 0.406: v14.22,74.42 14.22,72.64 15.11,71.88 15.11,69.09 15.88,68.33 15.88,66.93 16.64,66.17 16.64,64.77 17.14,64.26 17.14,62.74 17.78,62.1 17.78,60.96 18.92,59.82 20.83,59.82 21.59,59.05 22.73,59.05 23.62,58.17 25.4,58.17 26.04,57.4 27.43,57.4 28.19,56.77 29.46,56.77 30.35,55.88 31.88,55.88 32.64,55.12 34.04,55.12 35.33,53.82 JP2.3 35.97,51.28 R2.1 | JP7.29 10.12,85.13 v8.89,86.36
  Bottom 0.406: v8.89,86.36 11.43,83.82 11.43,76.2 13.34,74.42 v14.22,74.42
S3
  Top 0.406: JP7.19 12.61,71.25 13.34,71.25 14.22,70.36 14.22,68.71 14.99,67.94 14.99,66.67 15.75,65.91 15.75,64.52 16.38,63.88 16.38,62.36 17.02,61.72 17.02,60.58 18.54,59.05 20.45,59.05 21.21,58.29 22.48,58.29 23.37,57.4 24.89,57.4 25.65,56.64 27.18,56.64 27.94,55.88 29.21,55.88 29.97,55.12 31.37,55.12 32.79,53.69 JP2.4
  Bottom 0.406: D3.C D4.C 32.74,48.54 JP2.4
SD_ON  (via drill 0.6)
  Top 0.406: JP7.36 8.51,92.75 arc90 8.76,93 v8.76,93.98
  Bottom 0.406: Q3.1 R21.2 C6.2 4.15,115.34 4.19,115.34 4.19,105.39 5.19,104.39 7.76,104.39 8.76,103.39 v8.76,93.98
TX  (via drill 0.6)
  Top 0.406: v23.75,100.33 22.1,100.33 14.52,92.75 JP7.35 | v28.57,100.33 30.61,102.36 30.61,104.39 29.72,105.28 29.72,113.66 26.92,116.46 26.92,122.94 28.07,124.08 R5.2
  Bottom 0.406: v23.75,100.33 v28.57,100.33
USB_5V  (via drill 0.6)
  Top 0.406: Q7.1 11.68,30.42 | 11.68,30.42 R33.2 | 11.68,30.42 v11.68,28.7 | 31.25,16.51 R13.2
  Top 0.813: v23.75,16.13 D1.A 23.75,19.94 31.25,19.94 31.25,16.51 JP9.1
  Bottom 0.406: v23.75,16.13 23.75,27.29 23.73,28.32 arc89 23.1,28.7 v11.68,28.7
VBUS  (via drill 0.6)
  Top 0.406: JP8.38 48.39,95.29 48.39,94.11 51.44,94.11 v51.44,93.98 | v31.62,22.48 30.48,23.6 43.81,36.94 43.81,59.05 38.48,59.05 38.48,65.91 42.29,69.72 v42.29,70.87 | R13.1 35.56,16.51 v35.56,18.54
  Bottom 0.406: v51.44,93.98 51.44,79.5 50.55,78.61 45.59,78.61 41.53,74.55 41.53,73.28 42.29,72.52 v42.29,70.87 | v35.56,18.54 v31.62,22.48
VCC  (via drill 0.6)  (1 unrouted)
  Top 0.406: 14.35,49.57 v14.35,49.53 14.35,47.24 33.66,47.24 33.91,46.86 33.91,44.2 34.8,43.3 R2.2 37.72,43.3 | JP7.44 6.1,102.91 | v6.1,106.05 6.1,118 7.1,119 v7.75,119 | 37.72,43.3 R1.2 | 37.72,43.3 v37.72,37.34 | Q1.2 R6.2 | 54.23,111.51 54.19,111.55
  Top 0.813: 14.35,49.57 JP7.1 | 6.1,102.91 v6.1,106.05 | v31.88,106.05 v31.88,113.41 | v54.23,113.41 54.23,111.51 | 54.19,111.55 Q1.2
  Bottom 0.406: R3.2 15.35,43.31 14.35,44.31 v14.35,49.53 | C6.1 R21.1 Q3.2 8.53,119 v7.75,119 | JP1.5 57.42,22.35 58.42,23.35 58.42,32.89 57.02,34.29 54.36,34.29 53.34,33.27 40.64,33.27 37.72,36.2 v37.72,37.34
  Bottom 0.813: v31.88,113.41 v54.23,113.41 | v6.1,106.05 v31.88,106.05

### Text on the board
Pads: kvrrus@gmail.com